# Altium schematic sheet Hard_Soft_JTAG_Socket.SchDoc: Hard & Soft JTAG Socket
size A4; DocumentNumber: 4; SheetNumber: 4; SheetTotal: 12
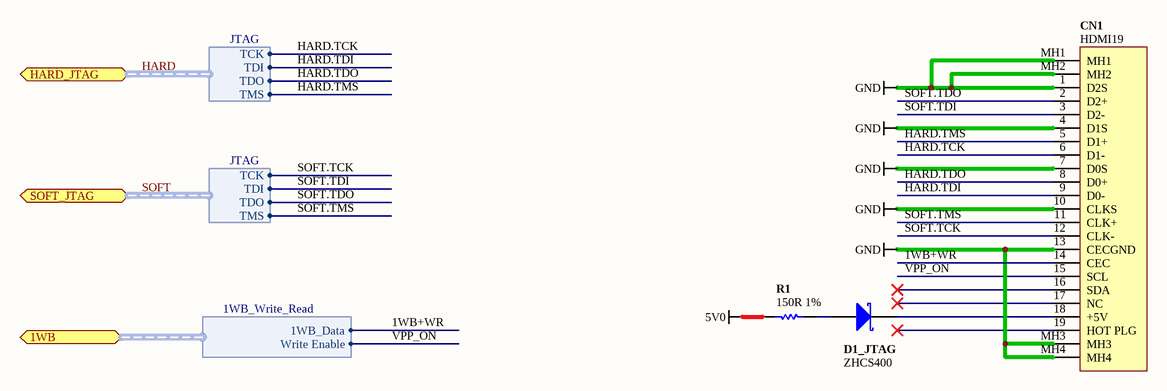
[diagram p0: Hard_Soft_JTAG_Socket.SchDoc]

## Parts
CN1  HDMI19  [G3168-0500XXXX-00]
D1_JTAG  ZHCS400  [SOD323]
R1  150R 1%  [RESC1005-STAR]

## Ports
1WB (harness 1WB_Write_Read), HARD_JTAG (harness JTAG), SOFT_JTAG (harness JTAG)

## Harnesses
1WB_Write_Read: 1WB_Data, Write Enable
JTAG: TCK, TDI, TDO, TMS

## Nets
5V0: R1.1
GND: CN1.1(D2S) CN1.4(D1S) CN1.7(D0S) CN1.10(CLKS) CN1.13(CECGND) CN1.MH1 CN1.MH2 CN1.MH3 CN1.MH4
1WB+WR: CN1.14(CEC) ; port 1WB.1WB_Data
HARD.TCK: CN1.6(D1-) ; port HARD_JTAG.TCK
HARD.TDI: CN1.9(D0-) ; port HARD_JTAG.TDI
HARD.TDO: CN1.8(D0+) ; port HARD_JTAG.TDO
HARD.TMS: CN1.5(D1+) ; port HARD_JTAG.TMS
SOFT.TCK: CN1.12(CLK-) ; port SOFT_JTAG.TCK
SOFT.TDI: CN1.3(D2-) ; port SOFT_JTAG.TDI
SOFT.TDO: CN1.2(D2+) ; port SOFT_JTAG.TDO
SOFT.TMS: CN1.11(CLK+) ; port SOFT_JTAG.TMS
VPP_ON: CN1.15(SCL) ; port 1WB.Write Enable
NetCN1_18: CN1.18(+5V) D1_JTAG.2(K)
NetD1_JTAG_1: D1_JTAG.1(A) R1.2

Not connected (* = marked no-connect by the designer): CN1 16(SDA)* 17(NC)* 19(HOT_PLG)*

## Buses and harness runs
harness HARD = port HARD_JTAG
harness SOFT = port SOFT_JTAG

## Notes on the sheet
- Sheet Title
- Project Title
- Size:
- Date:
- A4
- Assy:
- Time:
- Revision:
- Sheet
- of
- File:

## Library data of the parts
CN1 = D-300-0058: HDMI Socket; 19 Pin; Connector type: Right Angle; Max Current: mA; Category: Connector; Mounting Technology: Surface Mount; Status: Unreleased
D1_JTAG = D-151-0004: Schottky Diode, 400mA; Rated Voltage: mV; Category: Diode-Schottky; Max Forward Current: 400 mA; Mounting Technology: Surface Mount; Status: Unreleased
R1 = D-100-0005: Resistor, 150R 1% 0402 (1005); Power Rating: 63 mW; Category: Resistor; Mounting Technology: Surface Mount; Resistance: 150 R; Status: Unreleased; Tolerance: 1 %